# Altium schematic sheet IGruppioV2SCH (1).SCHDOC
size A2; PageSetup: Record=PageOptions|CenterHorizontal=True|CenterVertical=True|PrintScale=0.50|XCorrection=1.00|YCorrection=1.00|PrintKind=1|BorderSize=5000000|LeftOffset=0|BottomOffset=0|Orientation=2|PaperLength=1000|PaperWidth=1000|Scale=100|PaperSource=7|PrintQuality=600|MediaType=1|DitherType=10|PaperKind=A4|PrintScaleMode=1
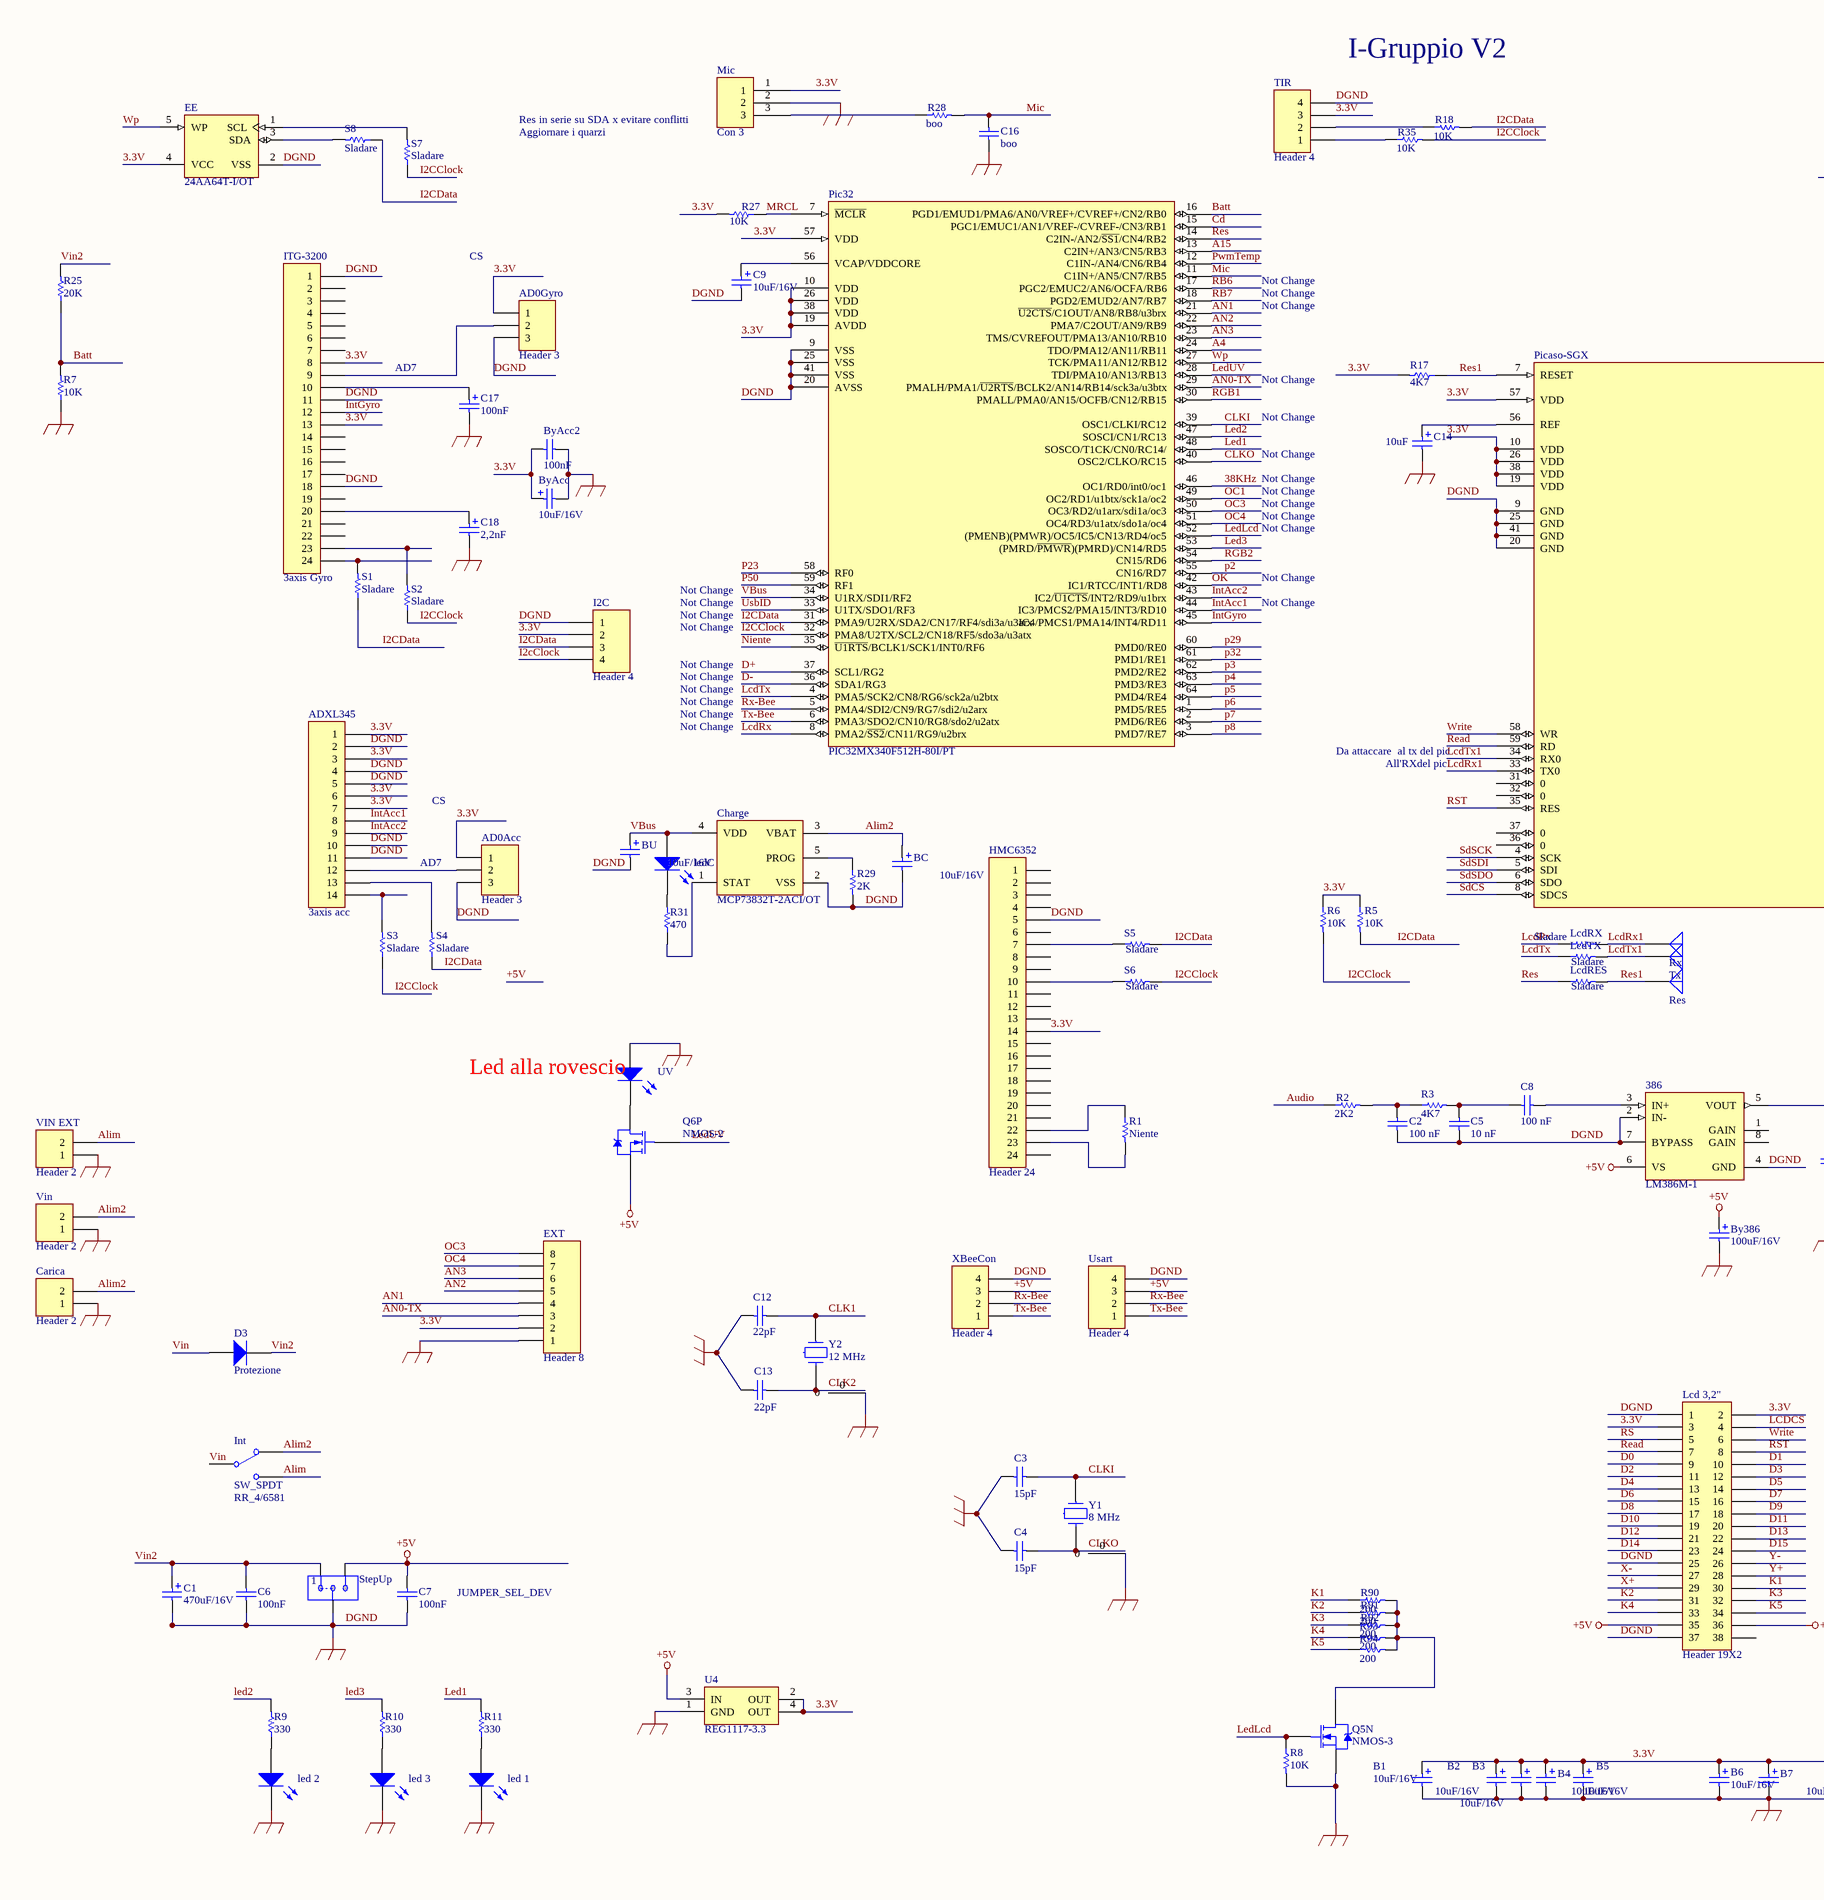
[diagram p0: IGruppioV2SCH (1).SCHDOC, left]
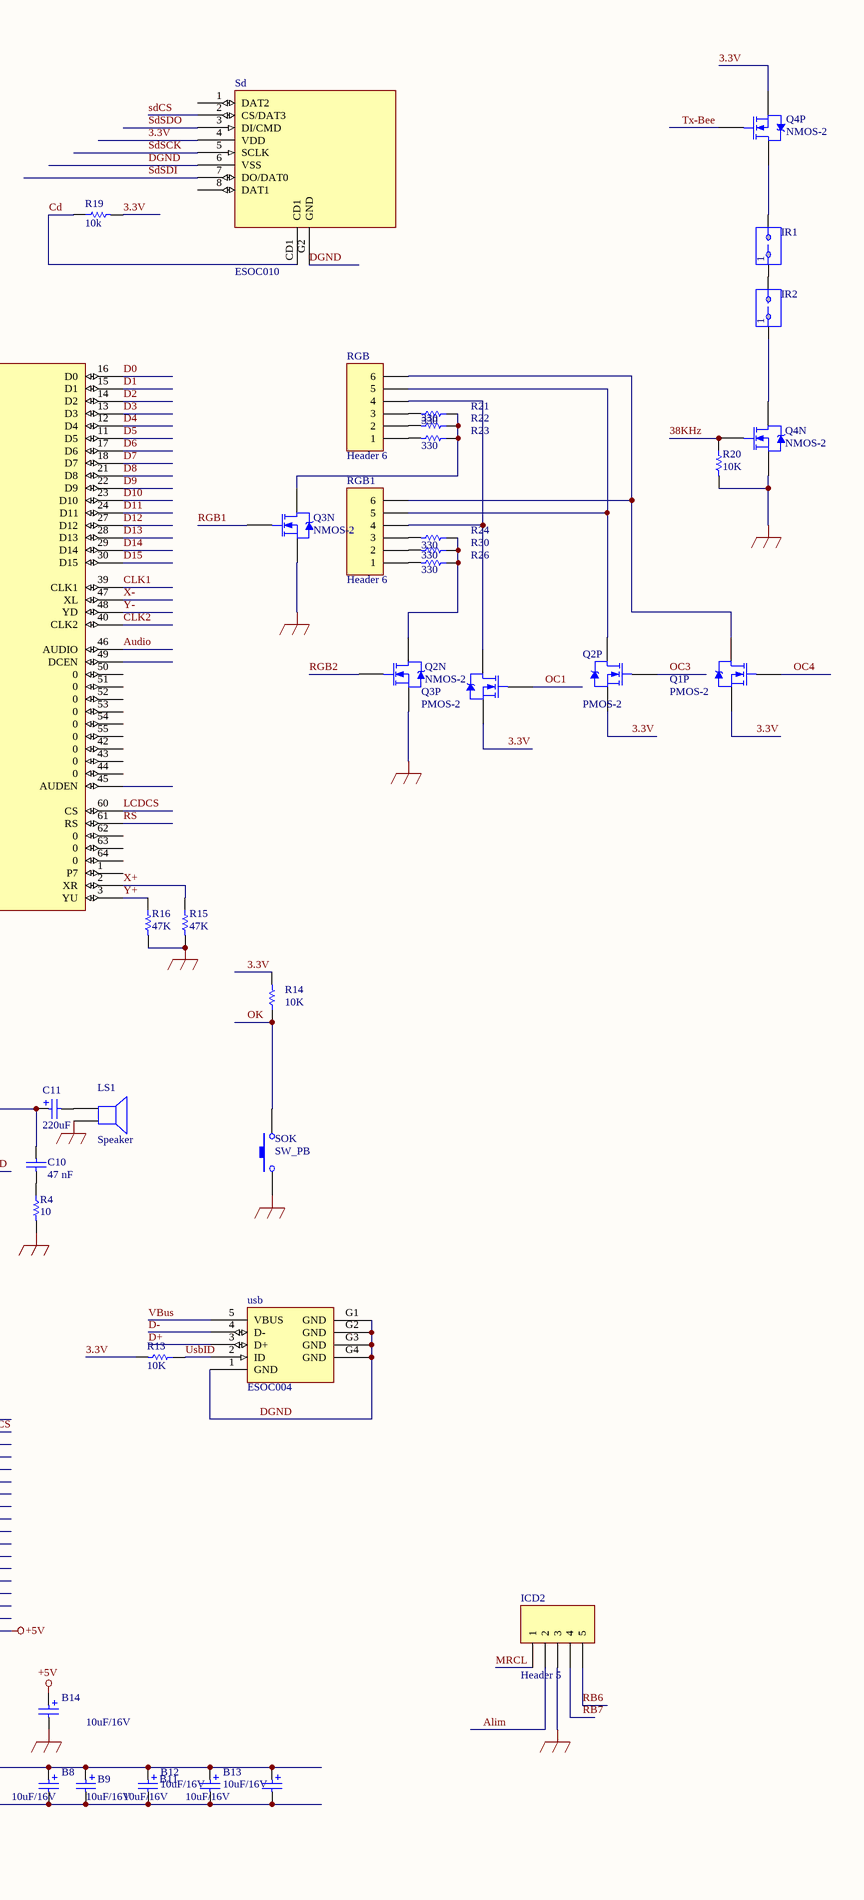
[diagram p1: IGruppioV2SCH (1).SCHDOC, right]

## Parts
386  LM386M-1  [M08A_N]
AD0Acc  Header 3  [Solder3]
AD0Gyro  Header 3  [Solder3]
ADXL345  3axis acc  [ADXL345]
B1  10uF/16V  [SMD 3.5]
B2  10uF/16V  [SMD 3.5 Signed]
B3  10uF/16V  [SMD 3.5 Signed]
B4  10uF/16V  [SMD 3.5 Signed]
B5  10uF/16V  [SMD 3.5 Signed]
B6  10uF/16V  [SMD 3.5]
B7  10uF/16V  [SMD 3.5 Signed]
B8  10uF/16V  [SMD 3.5 Signed]
B9  10uF/16V  [SMD 3.5 Signed]
B11  10uF/16V  [SMD 3.5 Signed]
B12  10uF/16V  [SMD 3.5 Signed]
B13  10uF/16V  [SMD 3.5 Signed]
B14  10uF/16V  [SMD 5.5 Signed]
BC  10uF/16V  [SMD 3.5 Signed]
BU  10uF/16V  [SMD 3.5 Signed]
By386  100uF/16V  [SMD 5.5mm]
ByAcc  10uF/16V  [SMD 3.5 Signed]
ByAcc2  100nF  [SMD 3.5 Signed]
C1  470uF/16V  [SMD 7mm]
C2  value 100 nF  [SMD 3.5 Signed]  (hidden comment: 100nF)
C3  15pF  [SMD 3mm]
C4  value 15pF  [SMD 3mm]  (hidden comment: 100nF)
C5  value 10 nF  [SMD 3.5 Signed]  (hidden comment: 10nF)
C6  100nF  [SMD 3.5 Signed]
C7  100nF  [SMD 3.5 Signed]
C8  value 100 nF  [SMD 3.5]  (hidden comment: 100nF)
C9  10uF/16V  [SMD 3.5 Signed]
C10  47 nF  [SMD 3.5 Signed]
C11  value 220uF  [SMD 5.5mm]
C12  22pF  [SMD 3mm]
C13  22pF  [SMD 3mm]
C14  value 10uF  [SMD 3.5 Signed]
C16  value boo  [SMD 3.5 Signed]  (hidden comment: 100nF)
C17  100nF  [SMD 3.5 Signed]
C18  2,2nF  [SMD 3.5 Signed]
Carica  Header 2  [Conn 2smd fem]
Charge  MCP73832T-2ACI/OT  [SOT-23-OT5_N]
D3  Protezione  [SMD 7mm]
EE  24AA64T-I/OT  [SOT-23-OT5_N]
EXT  Header 8  [Conn 8 smd fem - duplicate1]
HMC6352  Header 24  [Compass]
I2C  Header 4  [Conn 4 smd]
ICD2  Header 5  [Conn 5 smd fem lungo]
Int  SW_SPDT  Fornitore: RR_4/6581  [SwitchSMD]
IR1  (no value)  [Led 5mm]
IR2  (no value)  [Led 5mm]
ITG-3200  3axis Gyro  [Gyro Digital]
Lcd_3,2"  Header 19X2  [LCD3,2]
LcdRES  Sladare  [Solder]
LcdRX  Sladare  [Solder]
LcdTX  Sladare  [Solder]
led_1  Led Rosso 3mm  [SMD 3.5 Signed]  (value not drawn)
led_2  Led Rosso 3mm  [SMD 3.5 Signed]  (value not drawn)
led_3  Led Rosso 3mm  [SMD 3.5 Signed]  (value not drawn)
ledC  Led Rosso 3mm  [SMD 5.5]  (value not drawn)
LS1  Speaker  [Conn 2smd fem]
Mic  Con 3  [Mic mems]
Pic32  PIC32MX340F512H-80I/PT  [64 TQFP]
Picaso-SGX  PIC32MX340F512H-80I/PT  [64 TQFP]  (value not drawn)
Q1P  PMOS-2  [SOT-23]
Q2N  NMOS-2  [SOT-23]
Q2P  PMOS-2  [SOT-23]
Q3N  NMOS-2  [SOT-23]
Q3P  PMOS-2  [SOT-23]
Q4N  NMOS-2  [SOT-23]
Q4P  NMOS-2  [SOT-23]
Q5N  NMOS-3  [SOT-23]
Q6P  NMOS-2  [SOT-23]
R1  Niente  [SMD 3.5]
R2  2K2  [SMD 3.5]
R3  4K7  [SMD 3.5]
R4  10  [SMD 3.5]
R5  10K  [SMD 3.5]
R6  10K  [SMD 3.5]
R7  10K  [SMD 3.5]
R8  10K  [SMD 3.5]
R9  330  [SMD 3.5]
R10  330  [SMD 3.5]
R11  330  [SMD 3.5]
R13  10K  [SMD 3.5]
R14  10K  [SMD 3.5]
R15  47K  [SMD 3.5]
R16  47K  [SMD 3.5]
R17  4K7  [SMD 3.5]
R18  10K  [SMD 3.5]
R19  10k  [SMD 3.5]
R20  10K  [SMD 3.5]
R21  330  [SMD 3.5]
R22  330  [SMD 3.5]
R23  330  [SMD 3.5]
R24  330  [SMD 3.5]
R25  20K  [SMD 3.5]
R26  330  [SMD 3.5]
R27  10K  [SMD 3.5]
R28  boo  [SMD 3.5]
R29  2K  [SMD 3.5]
R30  330  [SMD 3.5]
R31  470  [SMD 3.5]
R35  10K  [SMD 3.5]
R90  200  [SMD 3.5]
R91  200  [SMD 3.5]
R92  200  [SMD 3.5]
R93  200  [SMD 3.5]
R94  200  [SMD 3.5]
Res  (no value)  [Pin]
RGB  Header 6  [RGB Smd2]
RGB1  Header 6  [RGB Smd2]
Rx  (no value)  [Pin]
S1  Sladare  [SMD 3.5]
S2  Sladare  [SMD 3.5]
S3  Sladare  [SMD 3.5]
S4  Sladare  [SMD 3.5]
S5  Sladare  [SMD 3.5]
S6  Sladare  [SMD 3.5]
S7  Sladare  [SMD 3.5]
S8  Sladare  [SMD 3.5]
Sd  ESOC010  [uSD]
SOK  SW_PB  [Pulsante piatto grande]
StepUp  JUMPER_SEL_DEV  [5VSwitcing]
TIR  Header 4  [SensTempIR]
Tx  (no value)  [Pin]
U4  REG1117-3.3  [ZZ311]
Usart  Header 4  [Conn 4 smd]
usb  ESOC004  [USBmini]
UV  Led Rosso 3mm  [Led 5mm]  (value not drawn)
Vin  Header 2  [JUMPER_SEL_2 - duplicate]
VIN_EXT  Header 2  [Conn 2smd fem]
XBeeCon  Header 4  [Conn 4 smd fem lungo]
Y1  8 MHz  [quarzo smd sparkfun - duplicate]
Y2  12 MHz  [quarzo smd sparkfun - duplicate]

## Nets
+5V: 386.6(VS) B14.1 By386.1 C7.1 Lcd_3,2".35 Lcd_3,2".36 Q6P.2(S) StepUp.3 U4.3(IN) Usart.3 XBeeCon.3
DGND: 386.2(IN-) 386.4(GND) 386.7(BYPASS) AD0Acc.3 AD0Gyro.3 ADXL345.2 ADXL345.4 ADXL345.5 ADXL345.10 ADXL345.11 B1.2 B2.2 B3.2 B4.2 B5.2 B6.2 B7.2 B8.2 B9.2 B11.2 B12.2 B13.2 B14.2 BC.2 BU.2 By386.2 ByAcc.2 ByAcc2.2 C1.2 C2.2 C3.1 C4.1 C5.2 C6.2 C7.2 C9.2 C12.2 C13.1 C14.2 C16.2 C17.2 C18.2 Carica.1 Charge.2(VSS) EE.2(VSS) EXT.1 HMC6352.5 I2C.1 ICD2.3 ITG-3200.1 ITG-3200.11 ITG-3200.18 Lcd_3,2".1 Lcd_3,2".25 Lcd_3,2".37 led_1.2(K) led_2.2(K) led_3.2(K) LS1.2 Mic.2 Pic32.9(VSS) Pic32.20(AVSS) Pic32.25(VSS) Pic32.41(VSS) Picaso-SGX.9(GND) Picaso-SGX.20(GND) Picaso-SGX.25(GND) Picaso-SGX.41(GND) Q2N.2(S) Q3N.2(S) Q4N.2(S) Q5N.2(S) R4.2 R7.1 R8.2 R15.2 R16.2 R20.2 R29.2 Sd.6(VSS) Sd.G2(GND) SOK.2 StepUp.2 TIR.4 U4.1(GND) Usart.4 usb.1(GND) usb.G1(GND) usb.G2(GND) usb.G3(GND) usb.G4(GND) UV.1(A) Vin.1 VIN_EXT.1 XBeeCon.4 Y1.0 Y2.0
3.3V: AD0Acc.1 AD0Gyro.1 ADXL345.1 ADXL345.3 ADXL345.6 ADXL345.7 B1.1 B2.1 B3.1 B4.1 B5.1 B6.1 B7.1 B8.1 B9.1 B11.1 B12.1 B13.1 ByAcc.1 ByAcc2.1 EE.4(VCC) EXT.2 HMC6352.14 I2C.2 ITG-3200.8 ITG-3200.13 Lcd_3,2".2 Lcd_3,2".3 Mic.1 Pic32.10(VDD) Pic32.19(AVDD) Pic32.26(VDD) Pic32.38(VDD) Pic32.57(VDD) Picaso-SGX.10(VDD) Picaso-SGX.19(VDD) Picaso-SGX.26(VDD) Picaso-SGX.38(VDD) Picaso-SGX.57(VDD) Q1P.2(S) Q2P.2(S) Q3P.2(S) Q4P.2(S) R5.1 R6.1 R13.2 R14.2 R17.2 R19.2 R27.2 Sd.4(VDD) TIR.3 U4.2(OUT) U4.4(OUT)
38KHz: Pic32.46(OC1/RD0/int0/oc1) Q4N.1(D) R20.1
A4: Pic32.24(TDO/PMA12/AN11/RB11)
A15: Pic32.13(C2IN+/AN3/CN5/RB3)
Alim: ICD2.2 Int.3 VIN_EXT.2
Alim2: BC.1 Carica.2 Charge.3(VBAT) Int.1 Vin.2
AN0-TX: EXT.3 Pic32.29(PMALH/PMA1/~{U2RTS}/BCLK2/AN14/RB14/sck3a/u3btx)
AN1: EXT.4 Pic32.21(~{U2CTS}/C1OUT/AN8/RB8/u3brx)
AN2: EXT.5 Pic32.22(PMA7/C2OUT/AN9/RB9)
AN3: EXT.6 Pic32.23(TMS/CVREFOUT/PMA13/AN10/RB10)
Audio: Picaso-SGX.46(AUDIO) R2.1
Batt: Pic32.16(PGD1/EMUD1/PMA6/AN0/VREF+/CVREF+/CN2/RB0) R7.2 R25.1
Cd: Pic32.15(PGC1/EMUC1/AN1/VREF-/CVREF-/CN3/RB1) R19.1 Sd.CD1
CLK1: C12.1 Picaso-SGX.39(CLK1) Y2.1
CLK2: C13.2 Picaso-SGX.40(CLK2) Y2.2
CLKI: C3.2 Pic32.39(OSC1/CLKI/RC12) Y1.1
CLKO: C4.2 Pic32.40(OSC2/CLKO/RC15) Y1.2
D0: Lcd_3,2".9 Picaso-SGX.16(D0)
D1: Lcd_3,2".10 Picaso-SGX.15(D1)
D2: Lcd_3,2".11 Picaso-SGX.14(D2)
D3: Lcd_3,2".12 Picaso-SGX.13(D3)
D4: Lcd_3,2".13 Picaso-SGX.12(D4)
D5: Lcd_3,2".14 Picaso-SGX.11(D5)
D6: Lcd_3,2".15 Picaso-SGX.17(D6)
D7: Lcd_3,2".16 Picaso-SGX.18(D7)
D8: Lcd_3,2".17 Picaso-SGX.21(D8)
D9: Lcd_3,2".18 Picaso-SGX.22(D9)
D10: Lcd_3,2".19 Picaso-SGX.23(D10)
D11: Lcd_3,2".20 Picaso-SGX.24(D11)
D12: Lcd_3,2".21 Picaso-SGX.27(D12)
D13: Lcd_3,2".22 Picaso-SGX.28(D13)
D14: Lcd_3,2".23 Picaso-SGX.29(D14)
D15: Lcd_3,2".24 Picaso-SGX.30(D15)
D+: Pic32.37(SCL1/RG2) usb.3(D+)
D-: Pic32.36(SDA1/RG3) usb.4(D-)
I2CClock: I2C.4 Pic32.32(PMA8/U2TX/SCL2/CN18/RF5/sdo3a/u3atx) R6.2 R35.2 S2.1 S3.1 S6.2 S7.1
I2CData: I2C.3 Pic32.31(PMA9/U2RX/SDA2/CN17/RF4/sdi3a/u3arx) R5.2 R18.2 S1.1 S4.1 S5.2 S8.1
IntAcc1: ADXL345.8 Pic32.44(IC3/PMCS2/PMA15/INT3/RD10)
IntAcc2: ADXL345.9 Pic32.43(IC2/~{U1CTS}/INT2/RD9/u1brx)
IntGyro: ITG-3200.12 Pic32.45(IC4/PMCS1/PMA14/INT4/RD11)
K1: Lcd_3,2".30 R90.1
K2: Lcd_3,2".31 R91.1
K3: Lcd_3,2".32 R92.1
K4: Lcd_3,2".33 R93.1
K5: Lcd_3,2".34 R94.1
LCDCS: Lcd_3,2".4 Picaso-SGX.60(CS)
LcdRx: LcdRX.1 Pic32.8(PMA2/~{SS2}/CN11/RG9/u2brx)
LcdRx1: LcdRX.2 Picaso-SGX.33(TX0) Rx.1
LcdTx: LcdTX.1 Pic32.4(PMA5/SCK2/CN8/RG6/sck2a/u2btx)
LcdTx1: LcdTX.2 Picaso-SGX.34(RX0) Tx.1
Led1: Pic32.48(SOSCO/T1CK/CN0/RC14/) R11.2
Led2: Pic32.47(SOSCI/CN1/RC13) R9.2
Led3: Pic32.53((PMRD/~{PMWR})(PMRD)/CN14/RD5) R10.2
LedLcd: Pic32.52((PMENB)(PMWR)/OC5/IC5/CN13/RD4/oc5) Q5N.1(D) R8.1
LedUV: Pic32.28(TDI/PMA10/AN13/RB13) Q6P.1(D)
Mic: C16.1 Pic32.11(C1IN+/AN5/CN7/RB5) R28.2
MRCL: ICD2.1 Pic32.7(~{MCLR}) R27.1
Niente: Pic32.35(~{U1RTS}/BCLK1/SCK1/INT0/RF6)
OC1: Pic32.49(OC2/RD1/u1btx/sck1a/oc2) Q3P.1(D)
OC3: EXT.8 Pic32.50(OC3/RD2/u1arx/sdi1a/oc3) Q2P.1(D)
OC4: EXT.7 Pic32.51(OC4/RD3/u1atx/sdo1a/oc4) Q1P.1(D)
OK: Pic32.42(IC1/RTCC/INT1/RD8) R14.1 SOK.1
p2: Pic32.55(CN16/RD7)
p3: Pic32.62(PMD2/RE2)
p4: Pic32.63(PMD3/RE3)
p5: Pic32.64(PMD4/RE4)
p6: Pic32.1(PMD5/RE5)
p7: Pic32.2(PMD6/RE6)
p8: Pic32.3(PMD7/RE7)
P23: Pic32.58(RF0)
p29: Pic32.60(PMD0/RE0)
p32: Pic32.61(PMD1/RE1)
P50: Pic32.59(RF1)
PwmTemp: Pic32.12(C1IN-/AN4/CN6/RB4)
RB6: ICD2.5 Pic32.17(PGC2/EMUC2/AN6/OCFA/RB6)
RB7: ICD2.4 Pic32.18(PGD2/EMUD2/AN7/RB7)
Read: Lcd_3,2".7 Picaso-SGX.59(RD)
Res: LcdRES.1 Pic32.14(C2IN-/AN2/~{SS1}/CN4/RB2)
Res1: LcdRES.2 Picaso-SGX.7(RESET) R17.1 Res.1
RGB1: Pic32.30(PMALL/PMA0/AN15/OCFB/CN12/RB15) Q3N.1(D)
RGB2: Pic32.54(CN15/RD6) Q2N.1(D)
RS: Lcd_3,2".5 Picaso-SGX.61(RS)
RST: Lcd_3,2".8 Picaso-SGX.35(RES)
Rx-Bee: Pic32.5(PMA4/SDI2/CN9/RG7/sdi2/u2arx) Usart.2 XBeeCon.2
SdCS: Picaso-SGX.8(SDCS) Sd.2(CS/DAT3)
SdSCK: Picaso-SGX.4(SCK) Sd.5(SCLK)
SdSDI: Picaso-SGX.5(SDI) Sd.7(DO/DAT0)
SdSDO: Picaso-SGX.6(SDO) Sd.3(DI/CMD)
Tx-Bee: Pic32.6(PMA3/SDO2/CN10/RG8/sdo2/u2atx) Q4P.1(D) Usart.1 XBeeCon.1
UsbID: Pic32.33(U1TX/SDO1/RF3) R13.1 usb.2(ID)
VBus: BU.1 Charge.4(VDD) ledC.1(A) Pic32.34(U1RX/SDI1/RF2) usb.5(VBUS)
Vin: D3.1(A) Int.2
Vin2: C1.1 C6.1 D3.2(K) R25.2 StepUp.1
Wp: EE.5(WP) Pic32.27(TCK/PMA11/AN12/RB12)
Write: Lcd_3,2".6 Picaso-SGX.58(WR)
X+: Lcd_3,2".29 Picaso-SGX.2(XR) R15.1
X-: Lcd_3,2".27 Picaso-SGX.47(XL)
Y+: Lcd_3,2".28 Picaso-SGX.3(YU) R16.1
Y-: Lcd_3,2".26 Picaso-SGX.48(YD)
Net386_3: 386.3(IN+) C8.1
Net386_5: 386.5(VOUT) C10.1 C11.1
NetAD0Acc_2: AD0Acc.2 ADXL345.12
NetAD0Gyro_2: AD0Gyro.2 ITG-3200.9
NetADXL345_13: ADXL345.13 S4.2
NetADXL345_14: ADXL345.14 S3.2
NetC2_1: C2.1 R2.2 R3.1
NetC5_1: C5.1 C8.2 R3.2
NetC9_1: C9.1 Pic32.56(VCAP/VDDCORE)
NetC10_2: C10.2 R4.1
NetC11_2: C11.2 LS1.1
NetC14_1: C14.1 Picaso-SGX.56(REF)
NetC17_1: C17.1 ITG-3200.10
NetC18_1: C18.1 ITG-3200.20
NetCharge_1: Charge.1(STAT) R31.1
NetCharge_5: Charge.5(PROG) R29.1
NetEE_1: EE.1(SCL) S7.2
NetEE_3: EE.3(SDA) S8.2
NetHMC6352_7: HMC6352.7 S5.1
NetHMC6352_10: HMC6352.10 S6.1
NetHMC6352_22: HMC6352.22 R1.1
NetHMC6352_23: HMC6352.23 R1.2
NetIR1_1: IR1.1 IR2.2
NetIR1_2: IR1.2 Q4P.3(G)
NetIR2_1: IR2.1 Q4N.3(G)
NetITG-3200_23: ITG-3200.23 S2.2
NetITG-3200_24: ITG-3200.24 S1.2
Netled_1_1: led_1.1(A) R11.1
Netled_2_1: led_2.1(A) R9.1
Netled_3_1: led_3.1(A) R10.1
NetledC_2: ledC.2(K) R31.2
NetMic_3: Mic.3 R28.1
NetQ1P_3: Q1P.3(G) RGB.6 RGB1.6
NetQ2N_3: Q2N.3(G) R24.1 R26.1 R30.1
NetQ2P_3: Q2P.3(G) RGB.5 RGB1.5
NetQ3N_3: Q3N.3(G) R21.1 R22.1 R23.1
NetQ3P_3: Q3P.3(G) RGB.4 RGB1.4
NetQ5N_3: Q5N.3(G) R90.2 R91.2 R92.2 R93.2 R94.2
NetQ6P_3: Q6P.3(G) UV.2(K)
NetR18_1: R18.1 TIR.2
NetR21_2: R21.2 RGB.3
NetR22_2: R22.2 RGB.2
NetR23_2: R23.2 RGB.1
NetR24_2: R24.2 RGB1.3
NetR26_2: R26.2 RGB1.1
NetR30_2: R30.2 RGB1.2
NetR35_1: R35.1 TIR.1

Not connected (* = marked no-connect by the designer): 386 1(GAIN) 8(GAIN); HMC6352 1 2 3 4 6 8 9 11 12 13 15 16 17 18 19 20 21 24; ITG-3200 2 3 4 5 6 7 14 15 16 17 19 21 22; Lcd_3,2" 38; Picaso-SGX 1(P7) 31(0) 32(0) 36(0) 37(0) 42(0) 43(0) 44(0) 45(AUDEN) 49(DCEN) 50(0) 51(0) 52(0) 53(0) 54(0) 55(0) 62(0) 63(0) 64(0); Sd 1(DAT2) 8(DAT1)

## Notes on the sheet
- I-Gruppio V2
- (near Mic) Res in serie su SDA x evitare conflitti
- Aggiornare i quarzi
- CS
- Not Change
- AD7
- (near Picaso-SGX) Da attaccare  al tx del pic
- All'RXdel pic
- (near UV) Led alla rovescio

## Library data of the parts
386 = LM386M-1: Low Voltage Audio Power Amplifier; Manufacturer: National Semiconductor; CompType: Audio IC; PackageTopMarking: NSZXTT*LM386*M-1; PowerWise: N; Published: 4-Dec-2008; DatasheetVersion: Aug-2000; PackageVersion: revL, Sep-2006; PackageReference: M08A; Publisher: Altium Limited; PackageDescription: SOIC Narrow, 4.9 x 3.9 x 1.45mm, 8 Lead, 1.27mm Pitch; PartNumber: LM386M-1; RoHS: O; PinCount: 8; DigiKeyPartNumber: LM386M-1-ND; Code_JEDEC: MS-012-AA; Code_IPC: SOIC127P600-8; ComponentLink1Description: LM386 Datasheet; ComponentLink1URL: http://www.national.com/ds/LM/LM386.pdf; ComponentLink2Description: LM386 Web Page; ComponentLink2URL: http://www.national.com/pf/LM/LM386.html; ComponentLink3Description: M08A Package Page; ComponentLink3URL: http://www.national.com/packaging/folders/m08a.html
AD0Acc AD0Gyro = Header 3: Header, 3-Pin; LatestRevisionDate: 17-Jul-2002; LatestRevisionNote: Re-released for DXP Platform.; Publisher: Altium Limited
ADXL345 = Header 14: Header, 14-Pin; LatestRevisionDate: 17-Jul-2002; LatestRevisionNote: Re-released for DXP Platform.; Publisher: Altium Limited
B1-B9 B11-B14 BC BU By386 = CAP_POL: Condensatore polarizzato; Value: 10uF; Published: 8-Jun-2000; Revision: July-2002: Re-released for DXP Platform.; Publisher: Altium Limited
ByAcc C9 C17 C18 = CAP_POL: Condensatore polarizzato; Value: 1uF; Published: 8-Jun-2000; Revision: July-2002: Re-released for DXP Platform.; Publisher: Altium Limited
ByAcc2 C6 C7 = CAP_NON POL_1: Capacitor; Revision: July-2002: Re-released for DXP Platform.; Publisher: Alberto Benda; Value: 100nF
C1 = CAP_POL: Condensatore polarizzato; Value: 470uF; Published: 8-Jun-2000; Revision: July-2002: Re-released for DXP Platform.; Publisher: Altium Limited
C2-C5 C8 C10 C12 C13 C16 = CAP_NON POL: Capacitor; Revision: July-2002: Re-released for DXP Platform.; Publisher: Alberto Benda
  C3: Value: 15pF
  C10: Value: 47 nF
  C12 C13: Value: 22pF
C11 C14 = CAP_POL: Condensatore polarizzato; Published: 8-Jun-2000; Revision: July-2002: Re-released for DXP Platform.; Publisher: Altium Limited
Carica Vin VIN_EXT = Header 2: Header, 2-Pin; Revision: 17-Jul-2002: Re-released for DXP Platform.; Publisher: Altium Limited
Charge = MCP73832T-2ACI/OT: Miniature Single-Cell, Fully Integrated Li-Ion, Li-Polymer Charge Management Controller, 4.2V, 5-Pin SOT-23, Industrial Temperature, Tape and Reel; FirstPublished: 29-Jan-2009; LatestRevisionDate: 27-Nov-2009; LatestRevisionNote: Updated to datasheet revision E, Sep-2008; DatasheetVersion: revE, Sep-2008; PackageVersion: revBB, Aug-2009; PackageReference: SOT-23-OT5; Publisher: Altium Limited; PackageDescription: 5-Lead Plastic Small Outline Transistor (OT) [SOT-23]; Supplier 1: Digi-Key; Supplier Part Number 1: MCP73832T-2ACI/OTTR-ND; Supplier 2: Digi-Key; Supplier Part Number 2: MCP73832T-2ACI/OTCT-ND; Supplier 3: Digi-Key; Supplier Part Number 3: MCP73832T-2ACI/OTDKR-ND; Supplier 4: Farnell; Supplier Part Number 4: 1332159; Supplier 5: Newark; Supplier Part Number 5: 88K5656; Code_IPC: SOT23-5; ComponentLink1Description: Datasheet; ComponentLink1URL: http://ww1.microchip.com/downloads/en/DeviceDoc/21984e.pdf; ComponentLink2Description: Packaging Specification; ComponentLink2URL: http://www.microchip.com/stellent/groups/techpub_sg/documents/packagingspec/en012702.pdf; ComponentLink3Description: Microchip.com Home; ComponentLink3URL: http://www.microchip.com/
D3 = DIODE_1N4001: 1 Amp General Purpose Rectifier; Revision 1: 11-Jul-2000: SIM Model Added.; Revision 2: 17-Jul-2002: Re-released for DXP Platform.; Package Information: Latest Revision: Aug-1999; Code - JEDEC: DO-204-AL; Published: 8-Jun-2000; Datasheet: Latest Revision: 1998; Package Reference: DO-41; Publisher: Altium Limited
EE = 24AA64T-I/OT: 64Kbit, 400kHz, 1.7V, I2C Serial EEPROM, 5-Pin SOT-23, Industrial Temperature, Tape and Reel; FirstPublished: 2-Dec-2009; DatasheetVersion: revQ, Jun-2009; PackageVersion: revBB, Aug-2009; PackageReference: SOT-23-OT5; Publisher: Altium Limited; PackageDescription: 5-Lead Plastic Small Outline Transistor (OT) [SOT-23]; Supplier 1: Digi-Key; Supplier Part Number 1: 24AA64T-I/OTTR-ND; Supplier 2: Digi-Key; Supplier Part Number 2: 24AA64T-I/OTDKR-ND; Supplier 3: Digi-Key; Supplier Part Number 3: 24AA64T-I/OTCT-ND; Supplier 4: Newark; Supplier Part Number 4: 08P0062; Code_IPC: SOT23-5; ComponentLink1Description: Datasheet; ComponentLink1URL: http://ww1.microchip.com/downloads/en/DeviceDoc/21189Q.pdf; ComponentLink2Description: Packaging Specification; ComponentLink2URL: http://www.microchip.com/stellent/groups/techpub_sg/documents/packagingspec/en012702.pdf; ComponentLink3Description: Microchip.com Home; ComponentLink3URL: http://www.microchip.com/
EXT = Header 8: Header, 8-Pin; LatestRevisionDate: 17-Jul-2002; LatestRevisionNote: Re-released for DXP Platform.; Publisher: Altium Limited
HMC6352 ITG-3200 = Header 24: Header, 24-Pin; LatestRevisionDate: 17-Jul-2002; LatestRevisionNote: Re-released for DXP Platform.; Publisher: Altium Limited
I2C TIR Usart XBeeCon = Header 4: Header, 4-Pin; LatestRevisionDate: 17-Jul-2002; LatestRevisionNote: Re-released for DXP Platform.; Publisher: Altium Limited
ICD2 = Header 5: Header, 5-Pin; Revision: 17-Jul-2002: Re-released for DXP Platform.; Publisher: Altium Limited
Int = SW_SPDT: SPDT Subminiature Toggle Switch, Right Angle Mounting, Vertical Actuation; Revision 1: Jul-2002: Re-released for DXP Platform.; Revision 2: 17-Dec-2003: Schematic revised, PCB Footprint replaced.; Published: 24-Mar-1999; Datasheet: Latest Revision: 05-Dec-2000; Publisher: Altium Limited
IR1 IR2 = JUMPER_SEL_2: Contattiera per jumper di selezione
Lcd_3,2" = Header 19X2: Header, 19-Pin, Dual row; LatestRevisionDate: 17-Jul-2002; LatestRevisionNote: Re-released for DXP Platform.; Publisher: Altium Limited
LcdRES LcdRX LcdTX R1-R11 R13-R31 R35 R90-R94 S1-S8 = RES_1: Resistor
  R1: Value: Niente
  R2: Value: 2K2
  R3 R17: Value: 4K7
  R4: Value: 10
  R5-R8 R13 R14 R18 R20 R27 R35: Value: 10K
  R9-R11 R21-R24 R26 R30: Value: 330
  R15 R16: Value: 47K
  R19: Value: 10k
  R25: Value: 20K
  R28: Value: boo
  R29: Value: 2K
  R31: Value: 470
  R90-R94: Value: 200
led_1-led_3 ledC UV = DIODE_LED_3: Typical BLUE SiC LED; Revision 1: Jul-2002: Re-released for DXP Platform.; Revision 2: 17-Dec-2003: PCB Footprint replaced.; Published: 8-Jun-2000; Publisher: Altium Limited
LS1 = Speaker: Loudspeaker; Published: 24-Mar-1999; LatestRevisionDate: 17-Jul-2002; LatestRevisionNote: Re-released for DXP Platform.; PackageReference: PIN2; Publisher: Altium Limited
Pic32 Picaso-SGX = PIC32MX340F512H-80I/PT: 32-Bit Flash Microcontroller with USB, 53 IOs, 512KB Program Memory, 64-pin TQFP; Published: 29-Jan-2009; DatasheetVersion: revE, Jul-2008; PackageVersion: revAW, Oct-2008; PackageReference: TQFP-PT64; Publisher: Altium Limited; PackageDescription: 64-Lead Thin Plastic Quad Flat Pack (PT) - 10x10x1mm Body, 2.00mm [TQFP]; Code_JEDEC: MS-026; ComponentLink1Description: Manufacturer Link; ComponentLink1URL: http://www.microchip.com; ComponentLink2Description: Datasheet; ComponentLink2URL: http://ww1.microchip.com/downloads/en/DeviceDoc/61143E.pdf; ComponentLink3Description: Packaging Specification; ComponentLink3URL: http://ww1.microchip.com/downloads/en/PackagingSpec/00049AW.pdf
Q1P Q2N Q2P Q3N Q3P Q4N Q4P Q5N Q6P = NMOS-2: N-Channel Power MOSFET; Note: Pin 2 is electrically connected to pin 4.; Code - JEDEC: TO-220-AB; Published: 8-Jun-2000; Revision: July-2002: Re-released for DXP Platform.; Datasheet: Latest Revision: PD-9.814; Package Reference: TO-220AB; Publisher: Altium Limited
Res Rx Tx = Antenna: Generic Antenna; Published: 24-Mar-1999; LatestRevisionDate: 17-Jul-2002; LatestRevisionNote: Re-released for DXP Platform.; PackageReference: PIN1; Publisher: Altium Limited
RGB RGB1 = Header 6: Header, 6-Pin; Revision: 17-Jul-2002: Re-released for DXP Platform.; Publisher: Altium Limited
Sd = ESOC010: CYSD801 -- TRANSFLASH CARD CONNECTOR
SOK = SW_PB: Switch; Published: 24-Mar-1999; Revision: July-2002: Re-released for DXP Platform.; Publisher: Altium Limited
StepUp = JUMPER_SEL_DEV: Contattiera per jumper di selezione
U4 = REG1117-3.3: 800mA and 1A Low Dropout Positive Regulator 2.85V, 3.3V, 5V, and Adjustable; Published: 8-Jun-2000; LatestRevisionDate: 17-Jul-2002; LatestRevisionNote: Re-released for DXP Platform.; DatasheetVersion: Sep-1997; PackageVersion: revC; PackageReference: ZZ311; Publisher: Altium Limited; PackageDescription: SOT-223/SC-73; 4 Leads; Body 6.7 x 7.3 mm, inc. leads (LxW max); ComponentLink1Description: Manufacturer Link; ComponentLink1URL: http://www.ti.com/; ComponentLink2Description: Datasheet; ComponentLink2URL: http://www-s.ti.com/sc/ds/REG1117.pdf
usb = ESOC004: 54819-0572 -- USB Mini-B Recept
Y1 Y2 = CRYSTAL_2GND: Crystal